# Altium schematic sheet Activity_Recognition_Board_v1.0_Audio.SchDoc
size A4
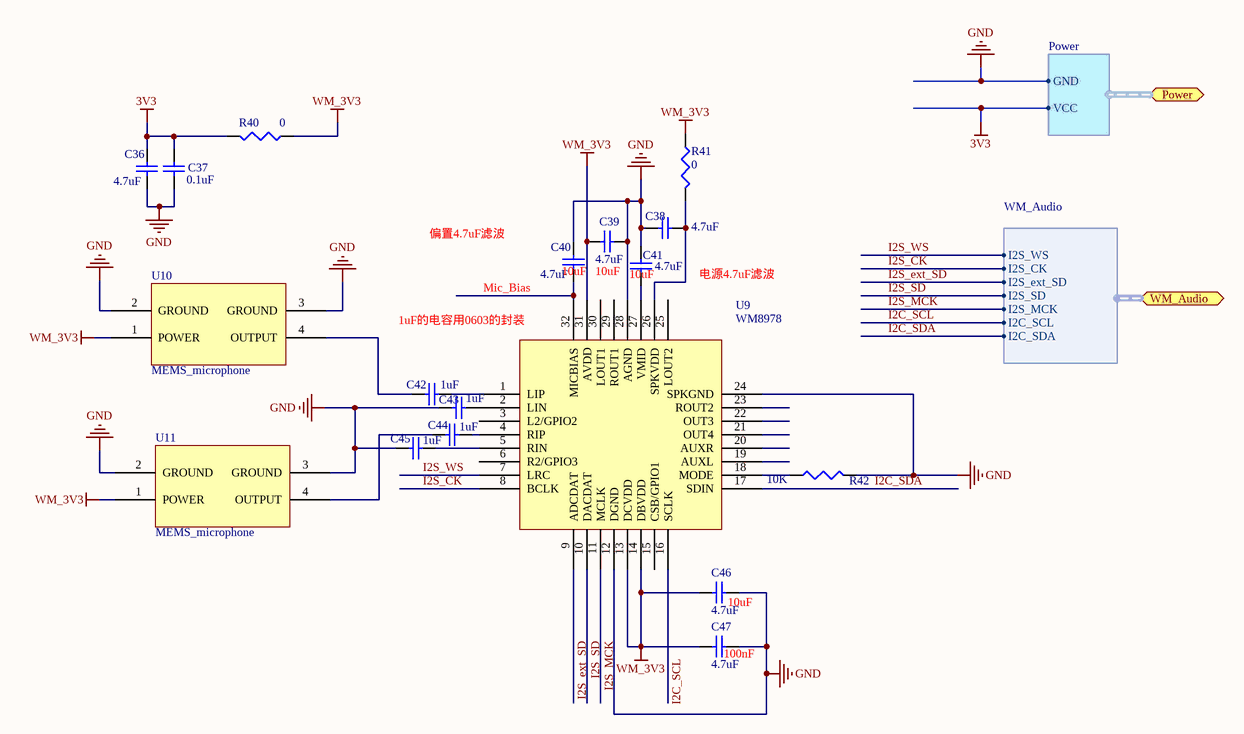
[diagram p0: Activity_Recognition_Board_v1.0_Audio.SchDoc]

## Parts
C36  value 4.7uF  [C0603]  (hidden comment: Cap semi)
C37  value 0.1uF  [C0402]  (hidden comment: Cap semi)
C38  value 4.7uF  [C0603]  (hidden comment: Cap semi)
C39  value 4.7uF  [C0603]  (hidden comment: Cap semi)
C40  value 4.7uF  [C0603]  (hidden comment: Cap semi)
C41  value 4.7uF  [C0603]  (hidden comment: Cap semi)
C42  value 1uF  [C0603]  (hidden comment: Cap semi)
C43  value 1uF  [C0603]  (hidden comment: Cap semi)
C44  value 1uF  [C0603]  (hidden comment: Cap semi)
C45  value 1uF  [C0603]  (hidden comment: Cap semi)
C46  value 4.7uF  [C0603]  (hidden comment: Cap semi)
C47  value 4.7uF  [C0603]  (hidden comment: Cap semi)
R40  value 0  [R0603]  (hidden comment: Res3)
R41  value 0  [R0402]  (hidden comment: Res3)
R42  value 10K  [R0402]  (hidden comment: Res3)
U9  WM8978  [QFN32]
U10  MEMS_microphone  [Microphone]
U11  MEMS_microphone  [Microphone]

## Ports
Power (harness Power), WM_Audio (harness WM_Audio)

## Harnesses
Power: VCC, GND
WM_Audio: I2S_WS, I2S_CK, I2S_ext_SD, I2S_SD, I2S_MCK, I2C_SCL, I2C_SDA

## Nets
3V3: C36.1 C37.1 R40.2 ; port Power.VCC
GND: C36.2 C37.2 C38.1 C39.2 C40.1 C41.1 C43.2 C45.2 C46.2 C47.2 R42.2 U9.12(DGND) U9.24(SPKGND) U9.28(AGND) U10.2(GROUND) U10.3(GROUND) U11.2(GROUND) U11.3(GROUND) ; port Power.GND
WM_3V3: C39.1 C46.1 C47.1 R40.1 R41.1 U9.13(DCVDD) U9.14(DBVDD) U9.31(AVDD) U10.1(POWER) U11.1(POWER)
I2C_SCL: U9.16(SCLK) ; port WM_Audio.I2C_SCL
I2C_SDA: U9.17(SDIN) ; port WM_Audio.I2C_SDA
I2S_CK: U9.8(BCLK) ; port WM_Audio.I2S_CK
I2S_ext_SD: U9.9(ADCDAT) ; port WM_Audio.I2S_ext_SD
I2S_MCK: U9.11(MCLK) ; port WM_Audio.I2S_MCK
I2S_SD: U9.10(DACDAT) ; port WM_Audio.I2S_SD
I2S_WS: U9.7(LRC) ; port WM_Audio.I2S_WS
Mic_Bias: C40.2 U9.32(MICBIAS)
NetC38_2: C38.2 R41.2 U9.26(SPKVDD)
NetC41_2: C41.2 U9.27(VMID)
NetC42_1: C42.1 U9.1(LIP)
NetC42_2: C42.2 U10.4(OUTPUT)
NetC43_1: C43.1 U9.2(LIN)
NetC44_1: C44.1 U9.4(RIP)
NetC44_2: C44.2 U11.4(OUTPUT)
NetC45_1: C45.1 U9.5(RIN)
NetR42_1: R42.1 U9.18(MODE)

Not connected (* = marked no-connect by the designer): U9 3(L2/GPIO2) 6(R2/GPIO3) 15(CSB/GPIO1) 19(AUXL) 20(AUXR) 21(OUT4) 22(OUT3) 23(ROUT2) 25(LOUT2) 29(ROUT1) 30(LOUT1)

## Notes on the sheet
- (near C40) 10uF
- 10uF
- (near C41) 10uF
- (near C46) 10uF
- (near C47) 100nF
- Labels drawn without touching a wire or pin: 1uF的电容用0603的封装, 偏置4.7uF滤波, 电源4.7uF滤波

## Library data of the parts
C36-C47 = Cap semi: Capacitor (Semiconductor SIM Model); Published: 8-Jun-2000; LatestRevisionDate: 29-May-2009; LatestRevisionNote: IPC-7351 Footprint Added.; PackageReference: C1206; Publisher: Altium Limited; PackageDescription: Chip Capacitor
R40-R42 = Res3: Resistor; Published: 8-Jun-2000; LatestRevisionDate: 29-May-2009; LatestRevisionNote: IPC-7351 Footprint Added.; PackageReference: J1-0603; Publisher: Altium Limited; PackageDescription: Chip Resistor